# Altium project motherboard 2 layer try.PrjPcb
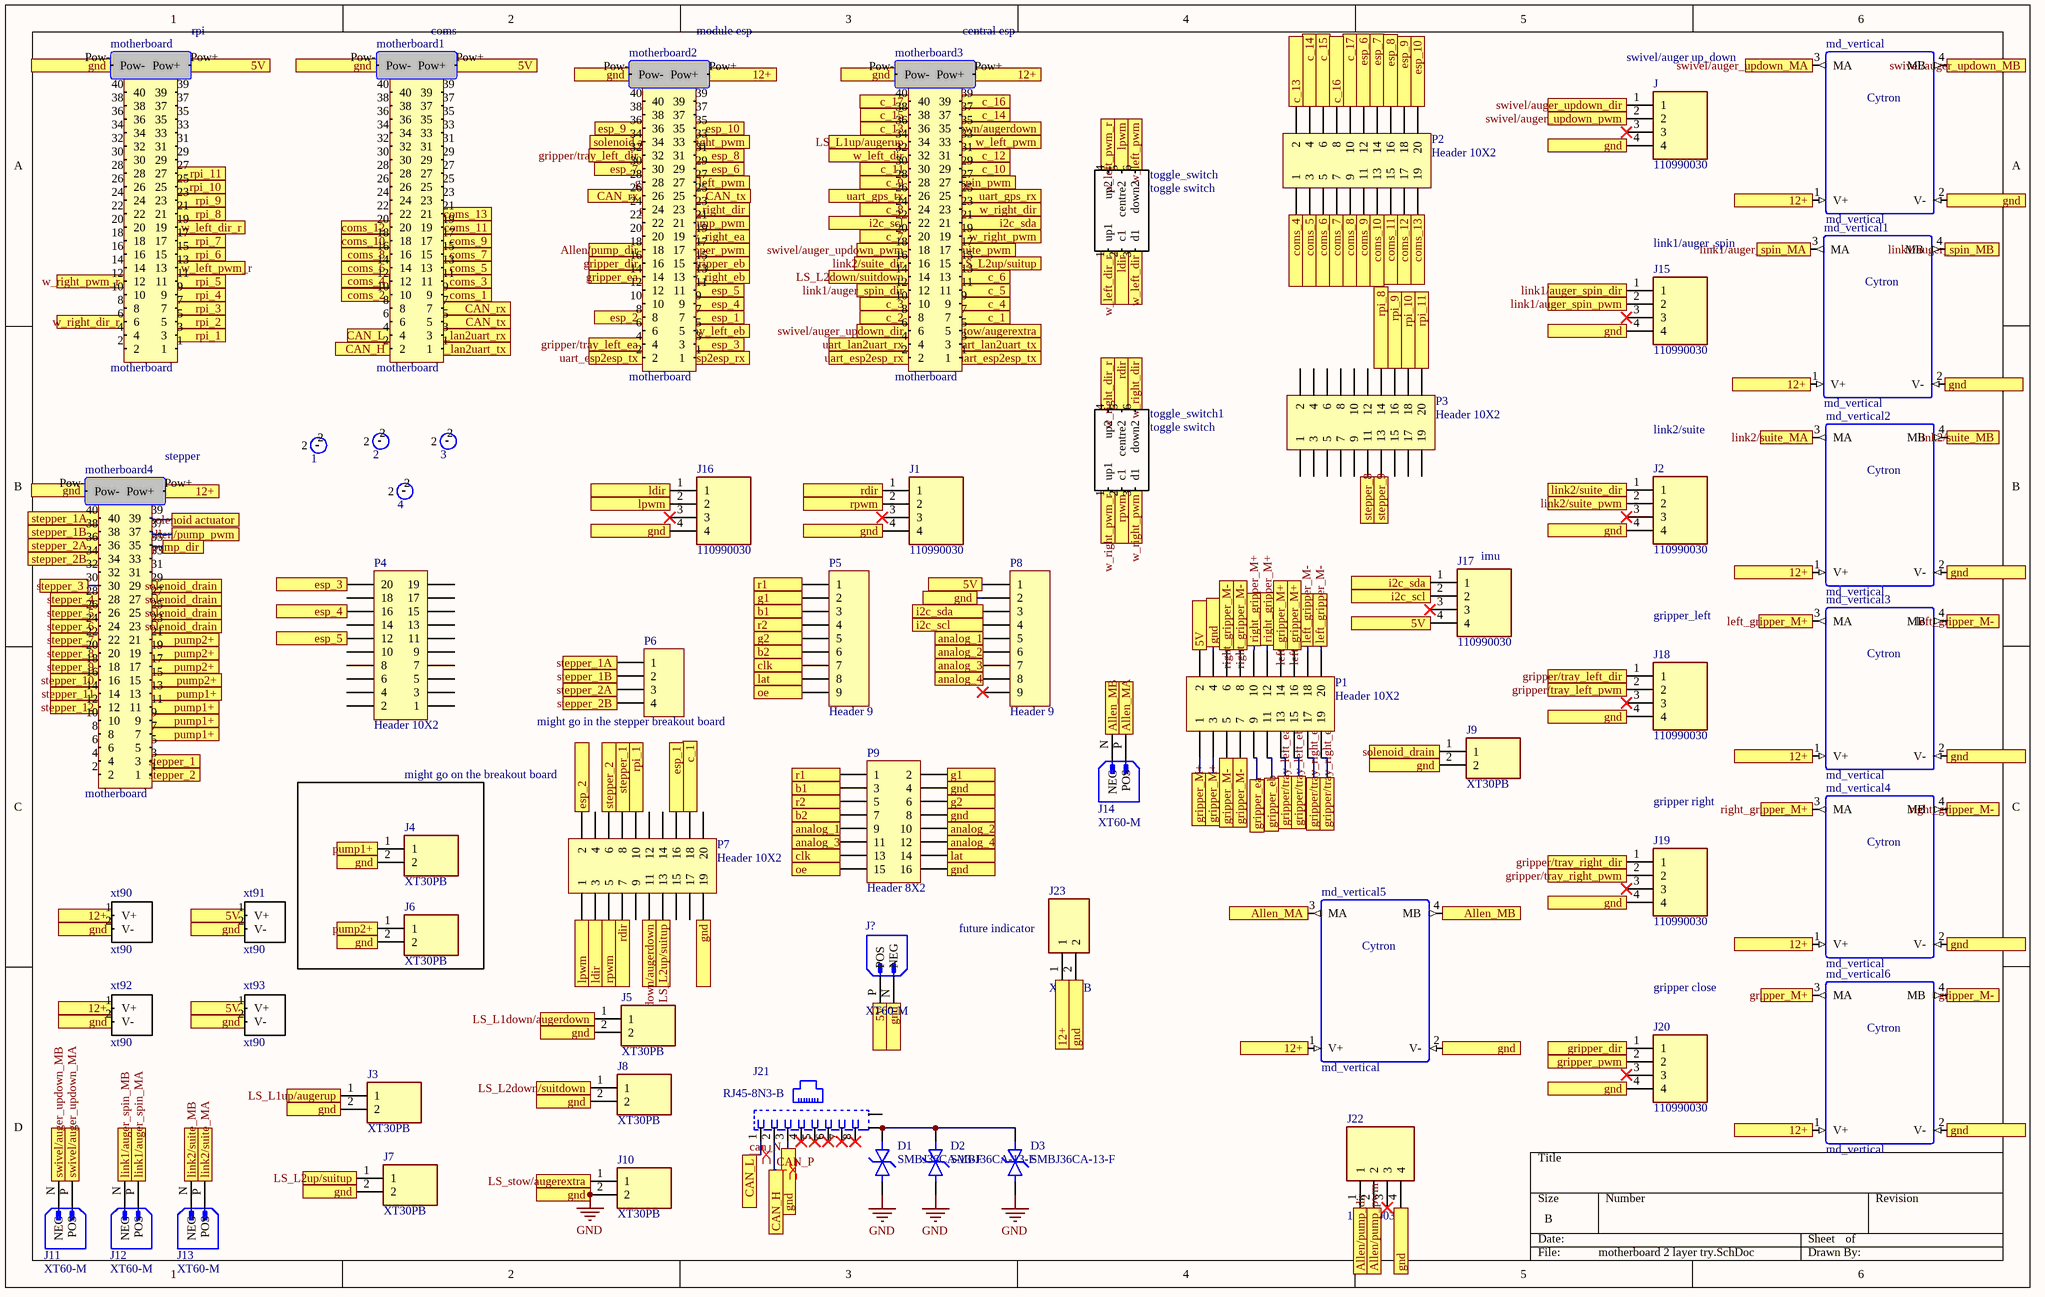
[diagram p0: motherboard 2 layer try.SchDoc]
1 sheet, 59 parts. Net scope: flat (ports and power ports of the same name join across sheets).
Board file: motherboard 2 layer try.PcbDoc

## Sheet motherboard 2 layer try.SchDoc
size B; SheetNumber: 1; SheetTotal: 1

### Parts
1  mountinghole_np  [np_mountinghole]  (value not drawn)
2  mountinghole_np  [np_mountinghole]  (value not drawn)
3  mountinghole_np  [np_mountinghole]  (value not drawn)
4  mountinghole_np  [np_mountinghole]  (value not drawn)
D1  SMBJ36CA-13-F  [DIONM4336X250N]
D2  SMBJ36CA-13-F  [DIONM4336X250N]
D3  SMBJ36CA-13-F  [DIONM4336X250N]
J  110990030  [SEEED_110990030]
J1  110990030  [SEEED_110990030]
J2  110990030  [SEEED_110990030]
J3  XT30PB  [XT30PB]
J4  XT30PB  [XT30PB]
J5  XT30PB  [XT30PB]
J6  XT30PB  [XT30PB]
J7  XT30PB  [XT30PB]
J8  XT30PB  [XT30PB]
J9  XT30PB  [XT30PB]
J10  XT30PB  [XT30PB]
J11  XT60-M  [AMASS_XT60-M]
J12  XT60-M  [AMASS_XT60-M]
J13  XT60-M  [AMASS_XT60-M]
J14  XT60-M  [AMASS_XT60-M]
J15  110990030  [SEEED_110990030]
J16  110990030  [SEEED_110990030]
J17  110990030  [SEEED_110990030]
J18  110990030  [SEEED_110990030]
J19  110990030  [SEEED_110990030]
J20  110990030  [SEEED_110990030]
J21  RJ45-8N3-B  [TE_RJ45-8N3-B]
J22  110990030  [SEEED_110990030]
J23  XT30PB  [XT30PB]
J?  XT60-M  [AMASS_XT60-M]
md_vertical  md_vertical  [md_vertical]
md_vertical1  md_vertical  [md_vertical]
md_vertical2  md_vertical  [md_vertical]
md_vertical3  md_vertical  [md_vertical]
md_vertical4  md_vertical  [md_vertical]
md_vertical5  md_vertical  [md_vertical]
md_vertical6  md_vertical  [md_vertical]
motherboard  motherboard  [motherboard 10x2]
motherboard1  motherboard  [motherboard 10x2]
motherboard2  motherboard  [motherboard 10x2]
motherboard3  motherboard  [motherboard 10x2]
motherboard4  motherboard  [motherboard 10x2]
P1  Header 10X2  [HDR2X10]
P2  Header 10X2  [HDR2X10]
P3  Header 10X2  [HDR2X10]
P4  Header 10X2  [HDR2X10]
P5  Header 9  [HDR1X9]
P6  might go in the stepper breakout board  [HDR1X4]
P7  Header 10X2  [HDR2X10]
P8  Header 9  [HDR1X9]
P9  Header 8X2  [HDR2X8]
toggle_switch  toggle switch  [toggle switch]
toggle_switch1  toggle switch  [toggle switch]
xt90  xt90  [xt90]
xt91  xt90  [xt90]
xt92  xt90  [xt90]
xt93  xt90  [xt90]

### Blocks framed on the sheet
might go on the breakout board: J4 J6

### Ports
5V, 12+, Allen/pump_dir, Allen/pump_pwm, Allen_MA, Allen_MB, analog_1, analog_2, analog_3, analog_4, b1, b2, c_1, c_2, c_3, c_4, c_5, c_6, c_7, c_8, c_9, c_10, c_11, c_12, c_13, c_14, c_15, c_16, c_17, CAN_H, CAN_L, CAN_rx, CAN_tx, clk, coms_1, coms_2, coms_3, coms_4, coms_5, coms_6, coms_7, coms_8, coms_9, coms_10, coms_11, coms_12, coms_13, esp_1, esp_2, esp_3, esp_4, esp_5, esp_6, esp_7, esp_8, esp_9, esp_10, g1, g2, gnd, gripper/tray_left_dir, gripper/tray_left_ea, gripper/tray_left_eb, gripper/tray_left_pwm, gripper/tray_right_dir, gripper/tray_right_ea, gripper/tray_right_eb, gripper/tray_right_pwm, gripper_dir, gripper_ea, gripper_eb, gripper_M+, gripper_M-, gripper_pwm, i2c_scl, i2c_sda, lat, ldir, left_gripper_M+, left_gripper_M-, link1/auger_spin_dir, link1/auger_spin_MA, link1/auger_spin_MB, link1/auger_spin_pwm, link2/suite_dir, link2/suite_MA, link2/suite_MB, link2/suite_pwm, lpwm, LS_L1down/augerdown, LS_L1up/augerup, LS_L2down/suitdown, LS_L2up/suitup, LS_stow/augerextra, oe, pump1+, pump2+, r1, r2, rdir, right_gripper_M+, right_gripper_M-, rpi_1, rpi_2, rpi_3, rpi_4, rpi_5, rpi_6, rpi_7, rpi_8, rpi_9, rpi_10, rpi_11, rpwm, solenoid actuator, solenoid_drain, stepper_1, stepper_1A, stepper_1B, stepper_2, stepper_2A, stepper_2B, stepper_3, stepper_4, stepper_5, stepper_6, stepper_7, stepper_8, stepper_9, stepper_10, stepper_11, stepper_12, swivel/auger_updown_dir, swivel/auger_updown_MA, swivel/auger_updown_MB, swivel/auger_updown_pwm, uart_esp2esp_rx, uart_esp2esp_tx, uart_gps_rx, uart_gps_tx, uart_lan2uart_rx, uart_lan2uart_tx, w_left_dir, w_left_dir_r, w_left_pwm, w_left_pwm_r, w_right_dir, w_right_dir_r, w_right_pwm, w_right_pwm_r

### Nets
GND: D1.1 D2.1 D3.1 J.4 J1.4 J2.4 J3.2 J4.2 J5.2 J6.2 J7.2 J8.2 J9.2 J10.2 J15.4 J16.4 J18.4 J19.4 J20.4 J21.3 J22.4 J23.2 J?.N(NEG) md_vertical.2(V-) md_vertical1.2(V-) md_vertical2.2(V-) md_vertical3.2(V-) md_vertical4.2(V-) md_vertical5.2(V-) md_vertical6.2(V-) motherboard.Pow- motherboard1.Pow- motherboard2.Pow- motherboard3.Pow- motherboard4.Pow- P1.4 P7.19 P8.2 P9.4 P9.8 P9.16 xt90.2(V-) xt91.2(V-) xt92.2(V-) xt93.2(V-) ; port gnd
can_N: J21.1 motherboard1.4 ; port CAN_L
CAN_P: J21.2 motherboard1.2 ; port CAN_H
NetD1_2: D1.2 D2.2 D3.2 J21.9(S1)
NetJ1_1: J1.1 P7.7 toggle_switch1.5(centre2) ; port rdir
NetJ1_2: J1.2 P7.5 toggle_switch1.2(c1) ; port rpwm
NetJ2_1: J2.1 motherboard3.16 ; port link2/suite_dir
NetJ2_2: J2.2 motherboard3.17 ; port link2/suite_pwm
NetJ3_1: J3.1 motherboard3.34 ; port LS_L1up/augerup
NetJ4_1: J4.1 motherboard4.7 motherboard4.9 motherboard4.11 motherboard4.13 ; port pump1+
NetJ5_1: J5.1 motherboard3.35 P7.11 ; port LS_L1down/augerdown
NetJ6_1: J6.1 motherboard4.15 motherboard4.17 motherboard4.19 motherboard4.21 ; port pump2+
NetJ7_1: J7.1 motherboard3.15 P7.13 ; port LS_L2up/suitup
NetJ8_1: J8.1 motherboard3.14 ; port LS_L2down/suitdown
NetJ9_1: J9.1 motherboard4.23 motherboard4.25 motherboard4.27 motherboard4.29 ; port solenoid_drain
NetJ10_1: J10.1 motherboard3.5 ; port LS_stow/augerextra
NetJ11_N: J11.N(NEG) md_vertical.4(MB) ; port swivel/auger_updown_MB
NetJ11_P: J11.P(POS) md_vertical.3(MA) ; port swivel/auger_updown_MA
NetJ12_N: J12.N(NEG) md_vertical1.4(MB) ; port link1/auger_spin_MB
NetJ12_P: J12.P(POS) md_vertical1.3(MA) ; port link1/auger_spin_MA
NetJ13_N: J13.N(NEG) md_vertical2.4(MB) ; port link2/suite_MB
NetJ13_P: J13.P(POS) md_vertical2.3(MA) ; port link2/suite_MA
NetJ14_N: J14.N(NEG) md_vertical5.4(MB) ; port Allen_MB
NetJ14_P: J14.P(POS) md_vertical5.3(MA) ; port Allen_MA
NetJ15_1: J15.1 motherboard3.12 ; port link1/auger_spin_dir
NetJ15_2: J15.2 motherboard3.27 ; port link1/auger_spin_pwm
NetJ16_1: J16.1 P7.3 toggle_switch.2(c1) ; port ldir
NetJ16_2: J16.2 P7.1 toggle_switch.5(centre2) ; port lpwm
NetJ17_1: J17.1 motherboard3.21 P8.3 ; port i2c_sda
NetJ17_2: J17.2 motherboard3.22 P8.4 ; port i2c_scl
NetJ17_4: J17.4 J?.P(POS) motherboard.Pow+ motherboard1.Pow+ P1.2 P8.1 xt91.1(V+) xt93.1(V+) ; port 5V
NetJ18_1: J18.1 motherboard2.32 ; port gripper/tray_left_dir
NetJ18_2: J18.2 motherboard2.27 ; port gripper/tray_left_pwm
NetJ19_1: J19.1 motherboard2.23 ; port gripper/tray_right_dir
NetJ19_2: J19.2 motherboard2.33 ; port gripper/tray_right_pwm
NetJ20_1: J20.1 motherboard2.16 ; port gripper_dir
NetJ20_2: J20.2 motherboard2.17 ; port gripper_pwm
NetJ22_1: J22.1 motherboard2.18 motherboard4.35 ; port Allen/pump_dir
NetJ22_2: J22.2 motherboard2.21 motherboard4.37 ; port Allen/pump_pwm
NetJ23_1: J23.1 md_vertical.1(V+) md_vertical1.1(V+) md_vertical2.1(V+) md_vertical3.1(V+) md_vertical4.1(V+) md_vertical5.1(V+) md_vertical6.1(V+) motherboard2.Pow+ motherboard3.Pow+ motherboard4.Pow+ xt90.1(V+) xt92.1(V+) ; port 12+
NetJ_1: J.1 motherboard3.6 ; port swivel/auger_updown_dir
NetJ_2: J.2 motherboard3.18 ; port swivel/auger_updown_pwm
Netmd_vertical3_3: md_vertical3.3(MA) P1.14 P1.16 ; port left_gripper_M+
Netmd_vertical3_4: md_vertical3.4(MB) P1.18 P1.20 ; port left_gripper_M-
Netmd_vertical4_3: md_vertical4.3(MA) P1.10 P1.12 ; port right_gripper_M+
Netmd_vertical4_4: md_vertical4.4(MB) P1.6 P1.8 ; port right_gripper_M-
Netmd_vertical6_3: md_vertical6.3(MA) P1.1 P1.3 ; port gripper_M+
Netmd_vertical6_4: md_vertical6.4(MB) P1.5 P1.7 ; port gripper_M-
Netmotherboard1_1: motherboard1.1 motherboard3.3 ; port uart_lan2uart_tx
Netmotherboard1_3: motherboard1.3 motherboard3.4 ; port uart_lan2uart_rx
Netmotherboard1_5: motherboard1.5 motherboard2.25 ; port CAN_tx
Netmotherboard1_7: motherboard1.7 motherboard2.26 ; port CAN_rx
Netmotherboard1_9: motherboard1.9 ; port coms_1
Netmotherboard1_10: motherboard1.10 ; port coms_2
Netmotherboard1_11: motherboard1.11 ; port coms_3
Netmotherboard1_12: motherboard1.12 P2.1 ; port coms_4
Netmotherboard1_13: motherboard1.13 P2.3 ; port coms_5
Netmotherboard1_14: motherboard1.14 P2.5 ; port coms_6
Netmotherboard1_15: motherboard1.15 P2.7 ; port coms_7
Netmotherboard1_16: motherboard1.16 P2.9 ; port coms_8
Netmotherboard1_17: motherboard1.17 P2.11 ; port coms_9
Netmotherboard1_18: motherboard1.18 P2.13 ; port coms_10
Netmotherboard1_19: motherboard1.19 P2.15 ; port coms_11
Netmotherboard1_20: motherboard1.20 P2.17 ; port coms_12
Netmotherboard1_21: motherboard1.21 P2.19 ; port coms_13
Netmotherboard2_1: motherboard2.1 motherboard3.2 ; port uart_esp2esp_rx
Netmotherboard2_2: motherboard2.2 motherboard3.1 ; port uart_esp2esp_tx
Netmotherboard2_3: motherboard2.3 P4.20 ; port esp_3
Netmotherboard2_4: motherboard2.4 P1.13 ; port gripper/tray_left_ea
Netmotherboard2_5: motherboard2.5 P1.15 ; port gripper/tray_left_eb
Netmotherboard2_7: motherboard2.7 P7.16 ; port esp_1
Netmotherboard2_8: motherboard2.8 P7.2 ; port esp_2
Netmotherboard2_9: motherboard2.9 P4.16 ; port esp_4
Netmotherboard2_11: motherboard2.11 P4.12 ; port esp_5
Netmotherboard2_13: motherboard2.13 P1.17 ; port gripper/tray_right_eb
Netmotherboard2_14: motherboard2.14 P1.9 ; port gripper_ea
Netmotherboard2_15: motherboard2.15 P1.11 ; port gripper_eb
Netmotherboard2_19: motherboard2.19 P1.19 ; port gripper/tray_right_ea
Netmotherboard2_29: motherboard2.29 P2.12 ; port esp_6
Netmotherboard2_30: motherboard2.30 P2.14 ; port esp_7
Netmotherboard2_31: motherboard2.31 P2.16 ; port esp_8
Netmotherboard2_34: motherboard2.34 motherboard4.39 ; port solenoid actuator
Netmotherboard2_35: motherboard2.35 P2.20 ; port esp_10
Netmotherboard2_36: motherboard2.36 P2.18 ; port esp_9
Netmotherboard3_7: motherboard3.7 P7.18 ; port c_1
Netmotherboard3_8: motherboard3.8 ; port c_2
Netmotherboard3_9: motherboard3.9 ; port c_4
Netmotherboard3_10: motherboard3.10 ; port c_3
Netmotherboard3_11: motherboard3.11 ; port c_5
Netmotherboard3_13: motherboard3.13 ; port c_6
Netmotherboard3_19: motherboard3.19 toggle_switch1.3(d1) ; port w_right_pwm
Netmotherboard3_20: motherboard3.20 ; port c_7
Netmotherboard3_23: motherboard3.23 toggle_switch1.6(down2) ; port w_right_dir
Netmotherboard3_24: motherboard3.24 ; port c_8
Netmotherboard3_25: motherboard3.25 ; port uart_gps_rx
Netmotherboard3_26: motherboard3.26 ; port uart_gps_tx
Netmotherboard3_28: motherboard3.28 ; port c_9
Netmotherboard3_29: motherboard3.29 ; port c_10
Netmotherboard3_30: motherboard3.30 ; port c_11
Netmotherboard3_31: motherboard3.31 ; port c_12
Netmotherboard3_32: motherboard3.32 toggle_switch.3(d1) ; port w_left_dir
Netmotherboard3_33: motherboard3.33 toggle_switch.6(down2) ; port w_left_pwm
Netmotherboard3_36: motherboard3.36 P2.2 ; port c_13
Netmotherboard3_37: motherboard3.37 P2.4 ; port c_14
Netmotherboard3_38: motherboard3.38 P2.6 ; port c_15
Netmotherboard3_39: motherboard3.39 P2.8 ; port c_16
Netmotherboard3_40: motherboard3.40 P2.10 ; port c_17
Netmotherboard4_1: motherboard4.1 P7.6 ; port stepper_2
Netmotherboard4_3: motherboard4.3 P7.8 ; port stepper_1
Netmotherboard4_12: motherboard4.12 ; port stepper_12
Netmotherboard4_14: motherboard4.14 ; port stepper_11
Netmotherboard4_16: motherboard4.16 ; port stepper_10
Netmotherboard4_18: motherboard4.18 P3.13 ; port stepper_9
Netmotherboard4_20: motherboard4.20 P3.11 ; port stepper_8
Netmotherboard4_22: motherboard4.22 ; port stepper_7
Netmotherboard4_24: motherboard4.24 ; port stepper_6
Netmotherboard4_26: motherboard4.26 ; port stepper_5
Netmotherboard4_28: motherboard4.28 ; port stepper_4
Netmotherboard4_30: motherboard4.30 ; port stepper_3
Netmotherboard4_34: motherboard4.34 P6.4 ; port stepper_2B
Netmotherboard4_36: motherboard4.36 P6.3 ; port stepper_2A
Netmotherboard4_38: motherboard4.38 P6.2 ; port stepper_1B
Netmotherboard4_40: motherboard4.40 P6.1 ; port stepper_1A
Netmotherboard_3: motherboard.3 P7.10 ; port rpi_1
Netmotherboard_5: motherboard.5 ; port rpi_2
Netmotherboard_6: motherboard.6 toggle_switch1.4(up2) ; port w_right_dir_r
Netmotherboard_7: motherboard.7 ; port rpi_3
Netmotherboard_9: motherboard.9 ; port rpi_4
Netmotherboard_11: motherboard.11 ; port rpi_5
Netmotherboard_12: motherboard.12 toggle_switch1.1(up1) ; port w_right_pwm_r
Netmotherboard_13: motherboard.13 toggle_switch.4(up2) ; port w_left_pwm_r
Netmotherboard_15: motherboard.15 ; port rpi_6
Netmotherboard_17: motherboard.17 ; port rpi_7
Netmotherboard_19: motherboard.19 toggle_switch.1(up1) ; port w_left_dir_r
Netmotherboard_21: motherboard.21 P3.14 ; port rpi_8
Netmotherboard_23: motherboard.23 P3.16 ; port rpi_9
Netmotherboard_25: motherboard.25 P3.18 ; port rpi_10
Netmotherboard_27: motherboard.27 P3.20 ; port rpi_11
NetP5_1: P5.1 P9.1 ; port r1
NetP5_2: P5.2 P9.2 ; port g1
NetP5_3: P5.3 P9.3 ; port b1
NetP5_4: P5.4 P9.5 ; port r2
NetP5_5: P5.5 P9.6 ; port g2
NetP5_6: P5.6 P9.7 ; port b2
NetP5_7: P5.7 P9.13 ; port clk
NetP5_8: P5.8 P9.14 ; port lat
NetP5_9: P5.9 P9.15 ; port oe
NetP8_5: P8.5 P9.9 ; port analog_1
NetP8_6: P8.6 P9.10 ; port analog_2
NetP8_7: P8.7 P9.11 ; port analog_3
NetP8_8: P8.8 P9.12 ; port analog_4

Not connected (* = marked no-connect by the designer): 1 2; 2 2; 3 2; 4 2; J 3*; J1 3*; J2 3*; J15 3*; J16 3*; J17 3*; J18 3*; J19 3*; J20 3*; J21 4* 5* 6* 7* 8* 10(S2); J22 3*; motherboard 1 2 4 8 10 14 16 18 20 22 24 26 28 29 30 31 32 33 34 35 36 37 38 39 40; motherboard1 6 8 22 23 24 25 26 27 28 29 30 31 32 33 34 35 36 37 38 39 40; motherboard2 6 10 12 20 22 24 28 37 38 39 40; motherboard4 2 4 5 6 8 10 31 32 33; P3 1 2 3 4 5 6 7 8 9 10 12 15 17 19; P4 1 2 3 4 5 6 7 8 9 10 11 13 14 15 17 18 19; P7 4 9 12 14 15 17 20; P8 9*

### Layout directives
differential pair: can_N, CAN_P

### Notes on the sheet
- (near motherboard) rpi
- (near motherboard1) coms
- (near motherboard2) module esp
- (near motherboard3) central esp
- (near J) swivel/auger up_down
- (near J15) link1/auger_spin
- (near J2) link2/suite
- (near motherboard4) stepper
- (near J17) imu
- gripper_left
- gripper right
- (near J23) future indicator
- gripper close
- (in symbol md_vertical) Cytron

### Library data of the parts
D1-D3 = SMBJ36CA-13-F: SMBJ36CA Series 600 W 36 V Surface Mount Bi-Directional TVS Diode - DO-214AA; Package: None; MP: SMBJ36CA-13-F; Value: *; Availability: Unavailable; Price: None
J J1 J2 J15-J20 J22 = 110990030: GROVE 2MM 4PIN VERT CONN 10PCS; MF: Seeed Technology; Arrow_Electronics-Purchase-URL: https://snapeda.com/shop?store=Arrow+Electronics&id=583576; Availability: Good; Package: None; Price: None; Mouser-Purchase-URL: https://snapeda.com/shop?store=Mouser&id=583576; MP: 110990030; SnapEDA_Link: https://www.snapeda.com/parts/110990030/Seeed%20Technology%20Co.,%20Ltd/view-part/583576/?ref=snap; Value: *
J3-J10 J23 = XT30PB: Connector; Manufacturer_Name: Amass; Datasheet Link: https://www.tme.eu/Document/4acc913878197f8c2e30d4b8cdc47230/XT30UPB%20SPEC.pdf; Height: 10.7mm; Manufacturer_Part_Number: XT30PB
J11-J14 J? = XT60-M: Plug; DC supply; XT60; male; PIN: 2; for cable; soldered; 30A; 500V; MF: AMASS; Package: Package; Availability: Not in stock; SnapEDA_Link: https://www.snapeda.com/parts/XT60-M/AMASS/view-part/?ref=snap; Check_prices: https://www.snapeda.com/parts/XT60-M/AMASS/view-part/?ref=eda; MP: XT60-M; Price: None; Value: *
J21 = RJ45-8N3-B: Connector RJ-45 Female 8 Position 2.54mm Solder Right Angle Through Hole 8 Terminal; MF: TE Connectivity; MP: RJ45-8N3-B; Price: None; Availability: Unavailable; Package: None; SnapEDA_Link: https://www.snapeda.com/parts/RJ45-8N3-B/TE%20Connectivity%20Corcom%20Filters/view-part/2770351/?ref=snap; TE_purchase_URL: https://www.te.com/usa-en/product-1-6609212-3.html?te_bu=Cor&te_type=disp&te_campaign=seda_glo_cor-seda-global-disp-prtnr-fy19-seda-model-bom-cta_sma-317_1&elqCampaignId=32493; Value: *
P1-P4 P7 = Header 10X2: Header, 10-Pin, Dual row; LatestRevisionDate: 17-Jul-2002; LatestRevisionNote: Re-released for DXP Platform.; Publisher: Altium Limited
P5 P8 = Header 9: Header, 9-Pin; LatestRevisionDate: 17-Jul-2002; LatestRevisionNote: Re-released for DXP Platform.; Publisher: Altium Limited
P6 = Header 4: Header, 4-Pin; LatestRevisionDate: 17-Jul-2002; LatestRevisionNote: Re-released for DXP Platform.; Publisher: Altium Limited
P9 = Header 8X2: Header, 8-Pin, Dual row; LatestRevisionDate: 17-Jul-2002; LatestRevisionNote: Re-released for DXP Platform.; Publisher: Altium Limited